# EAGLE design avr_lag2v2 (EAGLE 5.10)
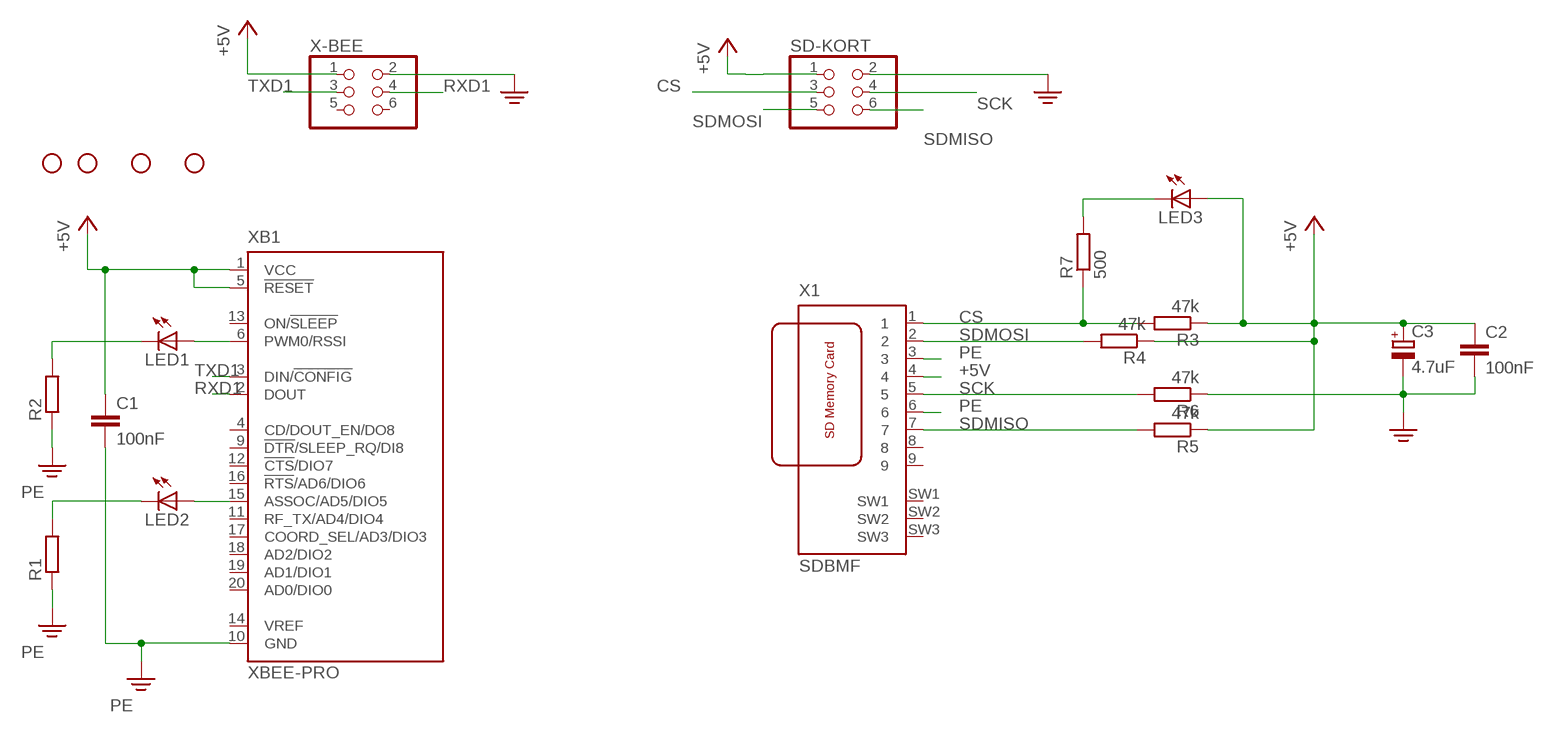
[diagram p0: schematic, sheet 1]

## Parts
C1  100nF  C-EU050-024X044  [C050-024X044]
C2  100nF  C-EU050-024X044  [C050-024X044]
C3  4.7uF  CPOL-EUE15-5AXIAL  [E15-5]
JP1  STAND-OFF  [STAND-OFF]
JP2  STAND-OFF  [STAND-OFF]
JP3  STAND-OFF  [STAND-OFF]
JP4  STAND-OFF  [STAND-OFF]
LED1  LED3MM  [LED3MM]
LED2  LED3MM  [LED3MM]
LED3  LED3MM  [LED3MM]
R1  R-EU_0207/10  [0207/10]
R2  R-EU_0207/10  [0207/10]
R3  47k  R-EU_0207/10  [0207/10]
R4  47k  R-EU_0207/10  [0207/10]
R5  47k  R-EU_0207/10  [0207/10]
R6  47k  R-EU_0207/10  [0207/10]
R7  500  R-EU_0207/10  [0207/10]
SD-KORT  PINHD-2X3  [2X03]
X1  SDBMF  [SDBMF-009XXBXX2]
X-BEE  PINHD-2X3  [2X03]
XB1  XBEE-PRO  [XBEE-PRO]

## Nets
+5V: C1.1 C2.1 C3.+ LED3.A R3.1 R4.1 R5.1 SD-KORT.1 X1.4 X-BEE.1 XB1.1(VCC) XB1.5(!RESET)
CS: R3.2 R7.1 SD-KORT.3 X1.1
N$1: LED1.K(C) R2.2
N$2: LED1.A XB1.6(PWM0/RSSI)
N$5: LED2.A XB1.15(ASSOC/AD5/DIO5)
N$6: LED2.K(C) R1.2
N$9: LED3.K(C) R7.2
PE: C1.2 C2.2 C3.- R1.1 R2.1 R6.1 SD-KORT.2 X1.3 X1.6 X-BEE.2 XB1.10(GND)
RXD1: X-BEE.4 XB1.2(DOUT)
SCK: R6.2 SD-KORT.4 X1.5
SDMISO: R5.2 SD-KORT.6 X1.7
SDMOSI: R4.2 SD-KORT.5 X1.2
TXD1: X-BEE.3 XB1.3(DIN/!CONFIG)
Unconnected: X1.8 X1.9 X1.SW1 X1.SW2 X1.SW3 X-BEE.5 X-BEE.6 XB1.4(CD/DOUT_EN/DO8) XB1.9(!DTR!/SLEEP_RQ/DI8) XB1.11(RF_TX/AD4/DIO4) XB1.12(!CTS!/DIO7) XB1.13(ON/!SLEEP) XB1.14(VREF) XB1.16(!RTS!/AD6/DIO6) XB1.17(COORD_SEL/AD3/DIO3) XB1.18(AD2/DIO2) XB1.19(AD1/DIO1) XB1.20(AD0/DIO0)

## Library data of the parts
C1 C2 = resistor:C-EU: CAPACITOR, European symbol
C3 = rcl:CPOL-EU: POLARIZED CAPACITOR, European symbol
JP1-JP4 = SparkFun:STAND-OFF: Stand Off This is the mechanical footprint for a #4 phillips button head screw. Use the keepout ring to avoid running the screw head into surrounding components. SKU : PRT-00447
LED1-LED3 = led:LED: LED OSRAM: - CHIPLED LG R971, LG N971, LY N971, LG Q971, LY Q971, LO R971, LY R971 LH N974, LH R974 LS Q976, LO Q976, LY Q976 LO Q996 - Hyper CHIPLED LW Q18S LB Q993, LB Q99A, LB R99A - SideLED LS A670, LO A670, LY A670, LG A670, LP A670 LB A673, LV A673, LT A673, LW A673 LH A674 LY A675 LS A676, LA A676, LO A676, LY A676, LW A676 LS A679, LY A679, LG A679 - Hyper Micro SIDELED® LS Y876, LA Y876, LO Y876, LY Y876 LT Y87S - SmartLED LW L88C, LW L88S LB L89C, LB L89S, LG L890 LS L89K, LO L89K, LY L89K LS L896, LA L896, LO L896, LY L896 - TOPLED LS T670, LO T670, LY T670, LG T670, LP T670 LSG T670, LSP T670, LSY T670, LOP T670, LYG T670 LG T671, LOG T671, LSG T671 LB T673, LV T673, LT T673, LW T673 LH T674 LS T676, LA T676, LO T676, LY T676, LB T676, LH T676, LSB T676, LW T676 LB T67C, LV T67C, LT T67C, LS T67K, LO T67K, LY T67K, LW E67C LS E67B, LA E67B, LO E67B, LY E67B, LB E67C, LV E67C, LT E67C LW T67C LS T679, LY T679, LG T679 LS T770, LO T770, LY T770, LG T770, LP T770 LB T773, LV T773, LT T773, LW T773 LH T774 LS E675, LA E675, LY E675, LS T675 LS T776, LA T776, LO T776, LY T776, LB T776 LHGB T686 LT T68C, LB T68C - Hyper Mini TOPLED® LB M676 - Mini TOPLED Santana® LG M470 LS M47K, LO M47K, LY M47K Source: http://www.osram.convergy.de LUXEON: - LUMILED® LXK2-PW12-R00, LXK2-PW12-S00, LXK2-PW14-U00, LXK2-PW14-V00 LXK2-PM12-R00, LXK2-PM12-S00, LXK2-PM14-U00 LXK2-PE12-Q00, LXK2-PE12-R00, LXK2-PE12-S00, LXK2-PE14-T00, LXK2-PE14-U00 LXK2-PB12-K00, LXK2-PB12-L00, LXK2-PB12-M00, LXK2-PB14-N00, LXK2-PB14-P00, LXK2-PB14-Q00 LXK2-PR12-L00, LXK2-PR12-M00, LXK2-PR14-Q00, LXK2-PR14-R00 LXK2-PD12-Q00, LXK2-PD12-R00, LXK2-PD12-S00 LXK2-PH12-R00, LXK2-PH12-S00 LXK2-PL12-P00, LXK2-PL12-Q00, LXK2-PL12-R00 Source: www.luxeon.com KINGBRIGHT: KA-3528ASYC Source: www.kingbright.com
R1-R7 = resistor:R-EU_: RESISTOR, European symbol
SD-KORT X-BEE = pinhead:PINHD-2X3: PIN HEADER
X1 = farnell:SDBMF: SD MEMORY CARD PUSH-PUSH WITH CONNECTOR TYPE B (BIG SWUÌTCH #3) KINGFONT PRECISION INDUSTIAL CO., LTD Source: http://www.farnell.com/datasheets/74273.pdf Best.-Nr.: 9186174 Hersteller: MULTICOMP Herstellerbez.: SDBMF-00915B0T2
XB1 = maxstream:XBEE: XBee (TM) /XBee-PRO(TM) OEM RF Modules Source: MaxStream, Inc. xbee_productmanual.pdf

## Board
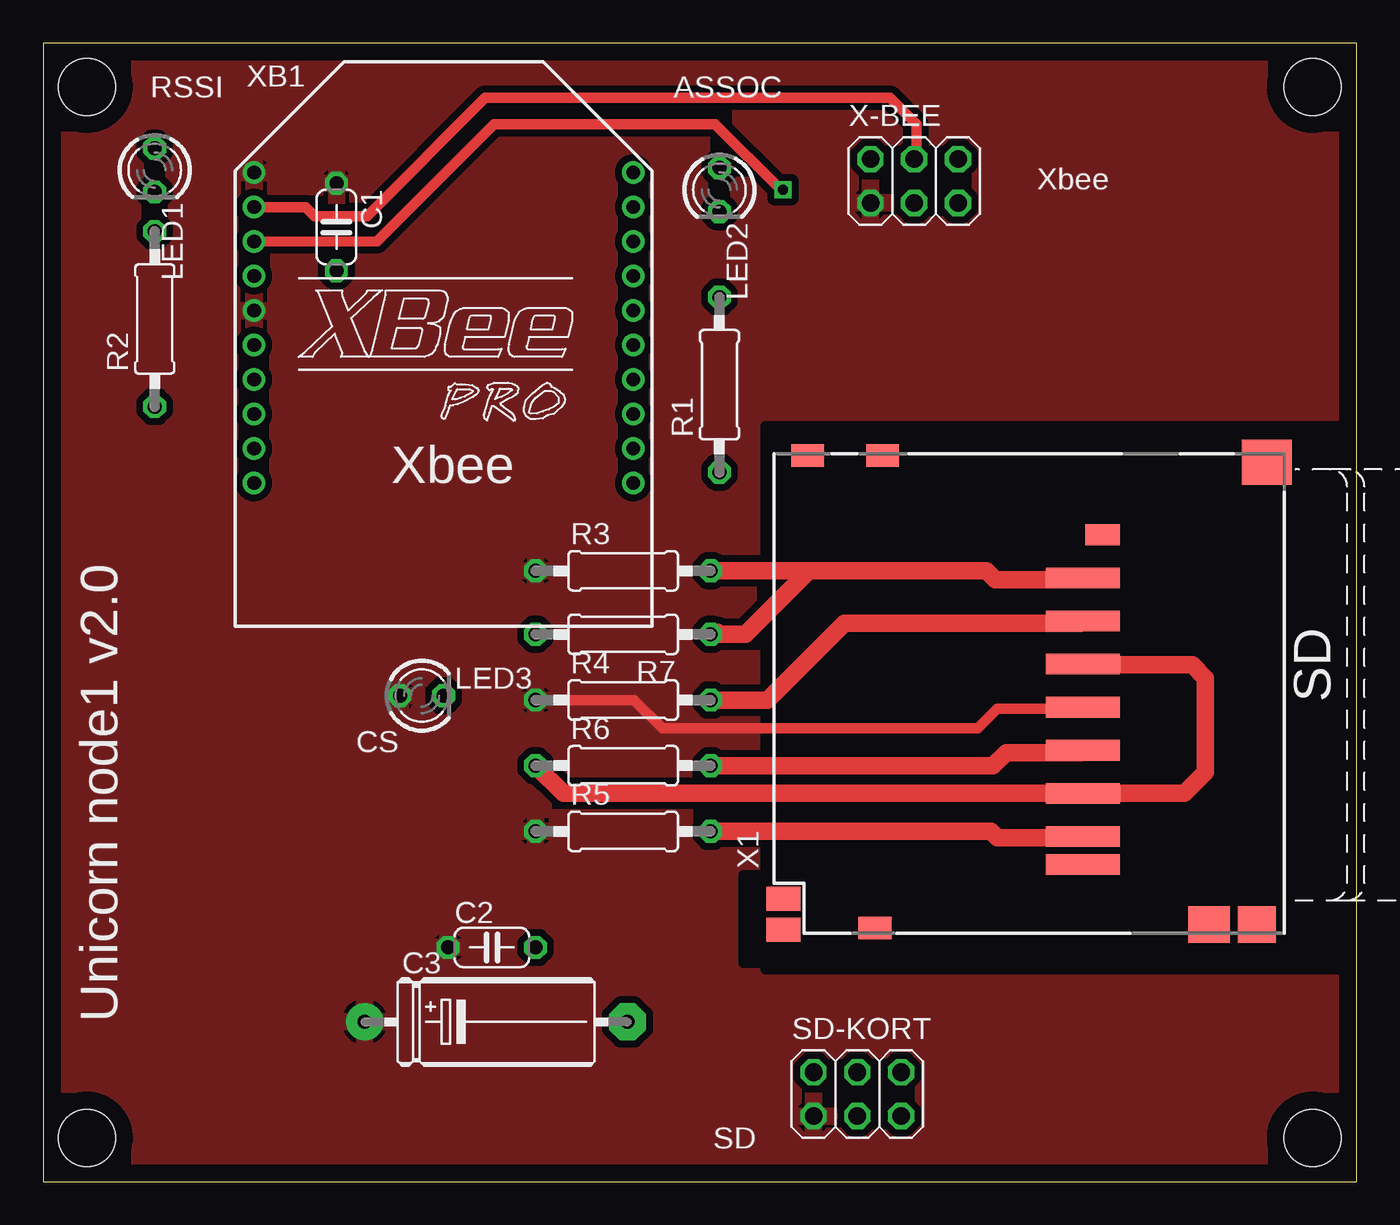
[diagram p1: board, top side]
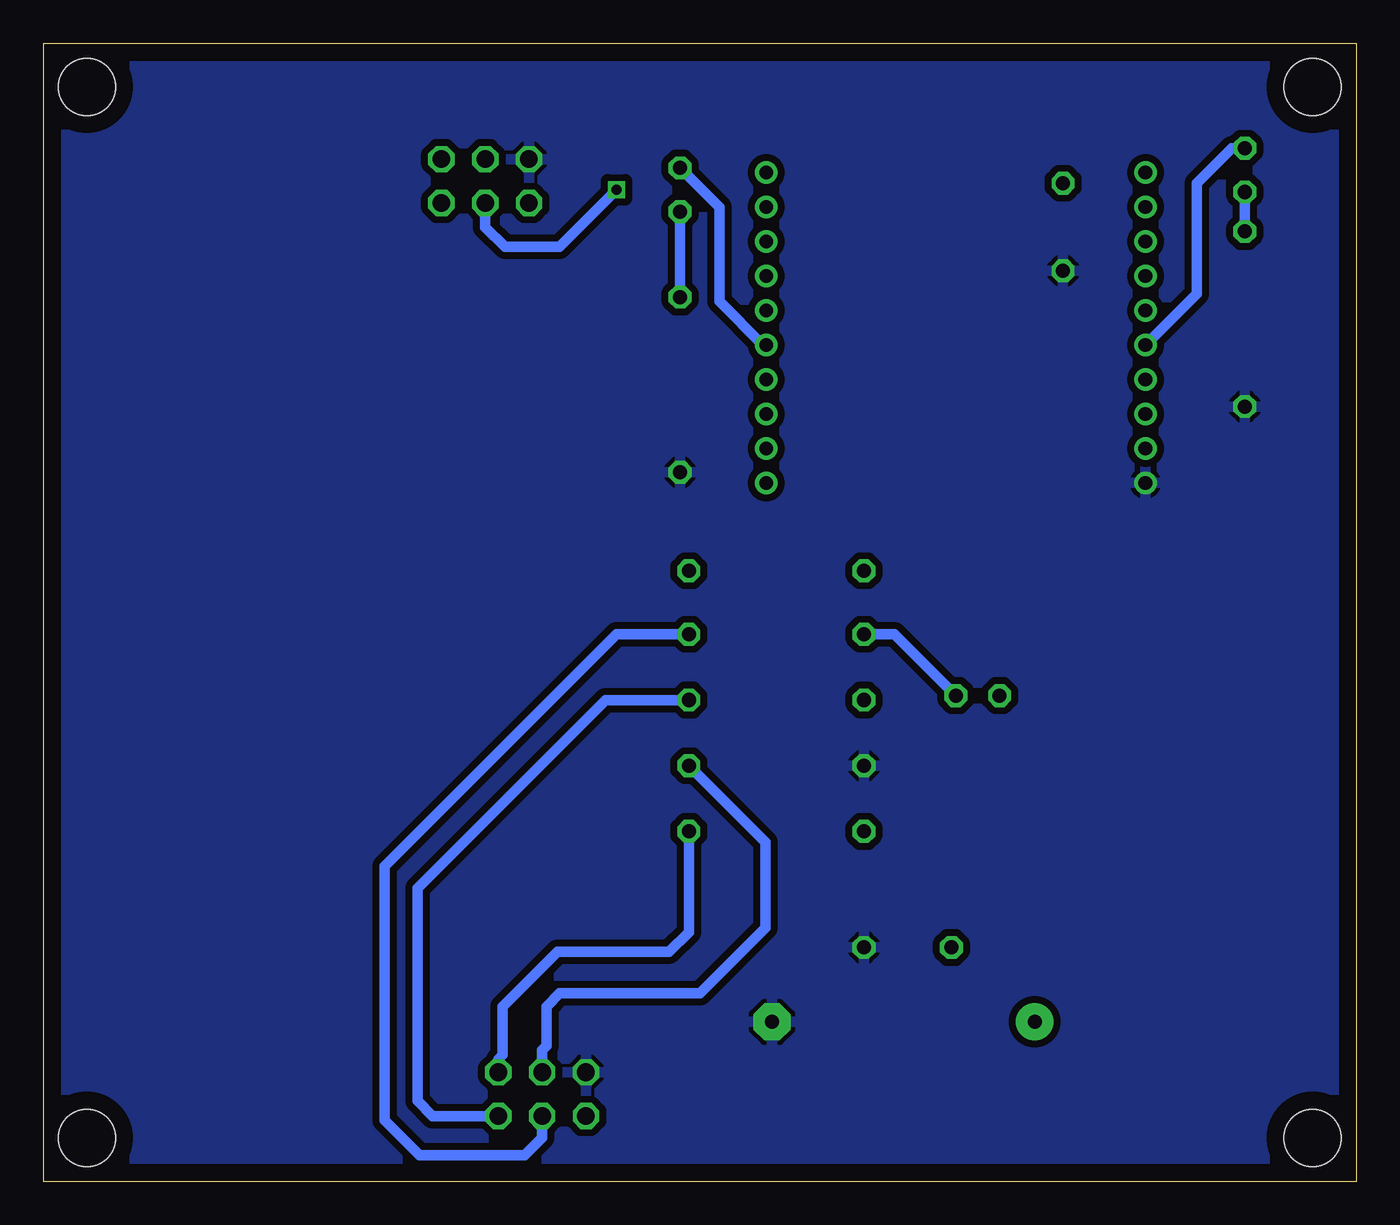
[diagram p2: board, bottom side, seen from below]

Size 76.2 x 66.04 mm. Coordinates in mm from the lower left corner, seen from the top.
Outline: 0,0 76.2,0 76.2,66.04 0,66.04 0,0
Copper layers (1*16): Top 0.035mm / dielectric 1.5mm / Bottom 0.035mm
Design rules "default *": minimum track width 10mil, minimum drill 24mil, track to track 16mil, track to pad 8mil, pad to pad 8mil, via to via 8mil, smd to smd 8mil, copper to edge 40mil, drill to drill 8mil, minimum pad ring 10mil, minimum via ring 8mil, stop-mask expansion 4mil, vias tented up to drill 0mil, thermal gap 10mil
tRestrict: area 56.5,17 to 64,39.2; area 41.9,12.3 to 75.1,43.8; area 40.6,12.7 to 43.2,17.8

### Footprints (pad centres in the part's own frame; a part is rotated, then mirrored left to right if it is on the bottom)
C050-024X044 = drill 0.813 octagon: 1 -2.54,0; 2 2.54,0
E15-5 = drill 0.813 pad 2.159 round: + -7.62,0 | drill 0.813 pad 2.159 octagon: - 7.62,0
STAND-OFF = hole 3.302: 0,0
LED3MM = drill 0.813 octagon: A -1.27,0; K 1.27,0
0207/10 = drill 0.813 octagon: 1 -5.08,0; 2 5.08,0
2X03 = drill 1.016 octagon: 1 -2.54,-1.27; 2 -2.54,1.27; 3 0,-1.27; 4 0,1.27; 5 2.54,-1.27; 6 2.54,1.27
SDBMF-009XXBXX2 = smd 1.2 x 4.3: 1 6.7,5.325; 2 4.2,5.325; 3 1.7,5.325; 4 -0.8,5.325; 5 -3.3,5.325; 6 -5.8,5.325; 7 -8.3,5.325; 8 -9.925,5.325 | smd 1.2 x 2: 9 9.2,4.175 | smd 2.1 x 2.4: M1 -13.4,-2 | smd 2.6 x 2.9: M2 13.4,-5.35 | smd 1.3 x 1.9: M3 -13.6,17.4; M4 13.8,16.95; M5 13.8,21.3 | smd 1.4 x 1.95: SW1 -11.9,22.7; SW3 -13.7,22.7 | smd 2.1 x 2.2: SW2 -13.4,-4.75
XBEE-PRO = drill 0.8 pad 1.27 round: 1 -11,9; 2 -11,7; 3 -11,5; 4 -11,3; 5 -11,1; 6 -11,-1; 7 -11,-3; 8 -11,-5; 9 -11,-7; 10 -11,-9; 11 11,-9; 12 11,-7; 13 11,-5; 14 11,-3; 15 11,-1; 16 11,1; 17 11,3; 18 11,5; 19 11,7; 20 11,9

### Placement (x,y rotation side)
C1  17.02,55.37 270 top
C2  26.04,13.59 0 top
C3  26.29,9.27 0 top
JP1  2.54,2.54 0 top
JP2  2.54,63.5 0 top
JP3  73.66,63.5 0 top
JP4  73.66,2.54 0 top
LED1  6.48,58.67 270 top
LED2  39.24,57.53 270 top
LED3  21.97,28.19 0 top
R1  39.24,46.23 90 top
R2  6.48,50.04 90 top
R3  33.66,35.43 0 top
R4  33.66,27.94 0 top
R5  33.66,20.32 0 top
R6  33.66,24.13 0 top
R7  33.66,31.75 180 top
SD-KORT  47.24,5.08 0 top
X1  65.66,28.32 90 top
X-BEE  50.55,58.04 0 top
XB1  23.24,49.53 0 top

### Tracks (layer width: path | path; a pad name or v marks a point on that pad's centre or on a via)
+5V
  Top 0.61: R4.1 34.29,27.94 35.94,26.29 54.23,26.29 55.37,27.43 60.24,27.43 X1.4
  pour Top (isolate 0.305): 0,0 76.2,0 76.2,66.04 0,66.04
CS
  Top 1.016: 44.45,35.43 R3.2 | 44.45,35.43 54.74,35.43 55.24,34.92 60.24,34.92 X1.1 | R7.1 38.99,31.75 | 38.99,31.75 39.12,31.88 | 38.99,31.75 40.77,31.75 44.45,35.43
  Bottom 0.61: SD-KORT.3 47.24,2.54 48.26,1.52 54.36,1.52 56.39,3.56 56.39,18.29 42.93,31.75 R7.1
N$1
  Bottom 0.61: R2.2 LED1.K
N$2
  Bottom 0.61: LED1.A 7.24,59.94 9.27,57.91 9.27,51.5 XB1.6
N$5
  Bottom 0.61: XB1.15 34.43,48.53 36.96,51.05 36.96,56.52 LED2.A
N$6
  Bottom 0.61: R1.2 LED2.K
N$9
  Bottom 0.61: R7.2 26.8,31.75 LED3.K
PE
  Top 1.016: X1.3 60.38,29.97 66.67,29.97 67.44,29.21 67.44,23.75 66.21,22.52 X1.6 30.18,22.52 R6.1
  pour Bottom (isolate 0.305): 76.2,0 76.2,66.04 0,66.04 0,0
RXD1
  Top 0.61: XB1.2 15.22,56.53 15.75,56.01 18.8,56.01 25.65,62.87 49.15,62.87 50.67,61.34 50.67,59.44 X-BEE.4
SCK
  Top 1.016: R6.2 55.12,24.13 55.88,24.89 60.2,24.89 X1.5
  Bottom 0.61: SD-KORT.4 47.24,7.62 46.99,7.87 46.99,10.16 46.23,10.92 38.1,10.92 34.29,14.73 34.29,19.68 R6.2
SDMISO
  Top 1.016: R5.2 54.99,20.32 55.37,19.94 60.25,19.94 X1.7
  Bottom 0.61: SD-KORT.6 49.78,7.11 49.53,7.37 49.53,10.16 46.35,13.34 39.88,13.34 38.73,14.48 R5.2
SDMOSI
  Top 1.016: R4.2 42.04,27.94 46.48,32.38 60.2,32.38 X1.2
  Bottom 0.61: SD-KORT.5 53.59,3.81 54.48,4.7 54.48,17.02 43.56,27.94 R4.2
TXD1  (via drill 0.6)
  Top 0.61: v42.93,57.53 42.8,57.53 38.99,61.34 26.16,61.34 19.37,54.55 XB1.3
  Bottom 0.61: X-BEE.3 50.55,55.37 49.4,54.23 46.23,54.23 v42.93,57.53

### Text on the board
tPlace: RSSI | ASSOC | Xbee | Xbee | SD | CS | Unicorn node1 v2.0 | SD